# Altium schematic sheet Touchscreen.SchDoc
size A
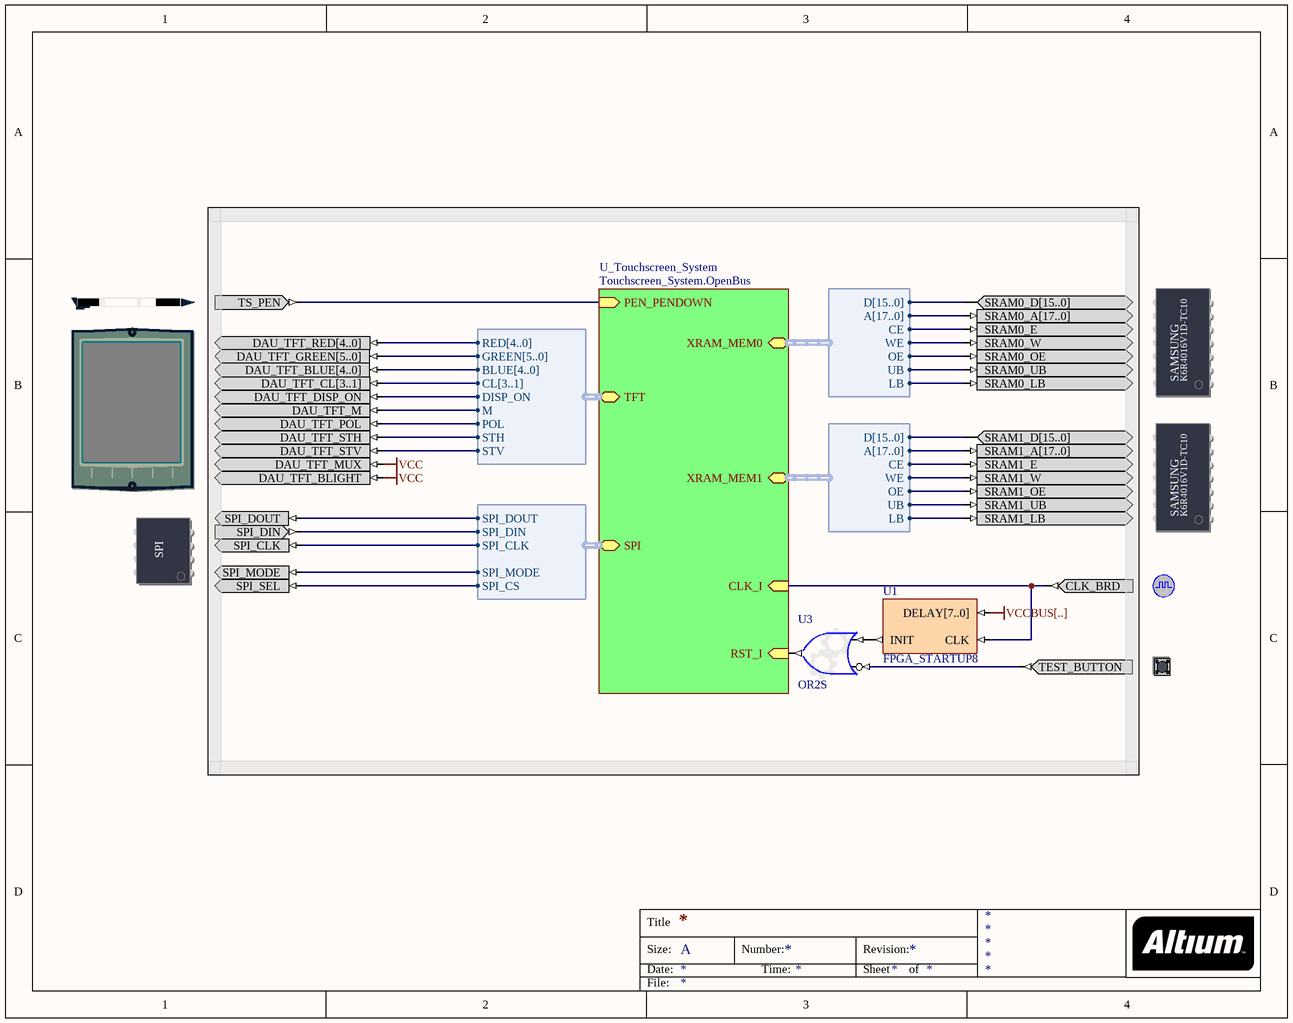
[diagram p0: Touchscreen.SchDoc]

## Parts
(Parts that share a designator on the sheet are numbered #1, #2 ... from top to bottom, then left to right.)
?#1  TOUCHSCREEN_PEN_DOWN  (value not drawn)
?#2  SRAM_DAUGHTER0  (value not drawn)
?#3  TFT_LCD  (value not drawn)
?#4  SRAM_DAUGHTER1  (value not drawn)
?#5  SPI_BUS  (value not drawn)
?#6  CLOCK_BOARD  (value not drawn)
?#7  TEST_BUTTON  (value not drawn)
U1  FPGA_STARTUP8
U3  OR2S

## Sub-sheets
U_Touchscreen_System = Touchscreen_System.OpenBus: CLK_I (in), RST_I (in), SPI (harness SPI_W_NB), PEN_PENDOWN (in), TFT (harness VGA32_TFT), XRAM_MEM0 (harness WB_MEM_CTRL_SRAM16_A18), XRAM_MEM1 (harness WB_MEM_CTRL_SRAM16_A18)

## Harnesses
WB_MEM_CTRL_SRAM16_A18: D[15..0], A[17..0], CE, WE, OE, UB, LB
VGA32_TFT: RED[4..0], GREEN[5..0], BLUE[4..0], CL[3..1], DISP_ON, M, POL, STH, STV
SPI_W_NB: SPI_DOUT, SPI_DIN, SPI_CLK, SPI_MODE, SPI_CS

## Nets
VCC: ?#3.DAU_TFT_BLIGHT ?#3.DAU_TFT_MUX
VCCBUS[..]: U1.DELAY[7..0]
Net?#1_TS_PEN: ?#1.TS_PEN ; sheet U_Touchscreen_System/PEN_PENDOWN
Net?#2_SRAM0_A[17..0]: ?#2.SRAM0_A[17..0] ; sheet U_Touchscreen_System/XRAM_MEM0.A[17..0]
Net?#2_SRAM0_D[15..0]: ?#2.SRAM0_D[15..0] ; sheet U_Touchscreen_System/XRAM_MEM0.D[15..0]
Net?#2_SRAM0_E: ?#2.SRAM0_E ; sheet U_Touchscreen_System/XRAM_MEM0.CE
Net?#2_SRAM0_LB: ?#2.SRAM0_LB ; sheet U_Touchscreen_System/XRAM_MEM0.LB
Net?#2_SRAM0_OE: ?#2.SRAM0_OE ; sheet U_Touchscreen_System/XRAM_MEM0.OE
Net?#2_SRAM0_UB: ?#2.SRAM0_UB ; sheet U_Touchscreen_System/XRAM_MEM0.UB
Net?#2_SRAM0_W: ?#2.SRAM0_W ; sheet U_Touchscreen_System/XRAM_MEM0.WE
Net?#3_DAU_TFT_BLUE[4..0]: ?#3.DAU_TFT_BLUE[4..0] ; sheet U_Touchscreen_System/TFT.BLUE[4..0]
Net?#3_DAU_TFT_CL[3..1]: ?#3.DAU_TFT_CL[3..1] ; sheet U_Touchscreen_System/TFT.CL[3..1]
Net?#3_DAU_TFT_DISP_ON: ?#3.DAU_TFT_DISP_ON ; sheet U_Touchscreen_System/TFT.DISP_ON
Net?#3_DAU_TFT_GREEN[5..0]: ?#3.DAU_TFT_GREEN[5..0] ; sheet U_Touchscreen_System/TFT.GREEN[5..0]
Net?#3_DAU_TFT_M: ?#3.DAU_TFT_M ; sheet U_Touchscreen_System/TFT.M
Net?#3_DAU_TFT_POL: ?#3.DAU_TFT_POL ; sheet U_Touchscreen_System/TFT.POL
Net?#3_DAU_TFT_RED[4..0]: ?#3.DAU_TFT_RED[4..0] ; sheet U_Touchscreen_System/TFT.RED[4..0]
Net?#3_DAU_TFT_STH: ?#3.DAU_TFT_STH ; sheet U_Touchscreen_System/TFT.STH
Net?#3_DAU_TFT_STV: ?#3.DAU_TFT_STV ; sheet U_Touchscreen_System/TFT.STV
Net?#4_SRAM1_A[17..0]: ?#4.SRAM1_A[17..0] ; sheet U_Touchscreen_System/XRAM_MEM1.A[17..0]
Net?#4_SRAM1_D[15..0]: ?#4.SRAM1_D[15..0] ; sheet U_Touchscreen_System/XRAM_MEM1.D[15..0]
Net?#4_SRAM1_E: ?#4.SRAM1_E ; sheet U_Touchscreen_System/XRAM_MEM1.CE
Net?#4_SRAM1_LB: ?#4.SRAM1_LB ; sheet U_Touchscreen_System/XRAM_MEM1.LB
Net?#4_SRAM1_OE: ?#4.SRAM1_OE ; sheet U_Touchscreen_System/XRAM_MEM1.OE
Net?#4_SRAM1_UB: ?#4.SRAM1_UB ; sheet U_Touchscreen_System/XRAM_MEM1.UB
Net?#4_SRAM1_W: ?#4.SRAM1_W ; sheet U_Touchscreen_System/XRAM_MEM1.WE
Net?#5_SPI_CLK: ?#5.SPI_CLK ; sheet U_Touchscreen_System/SPI.SPI_CLK
Net?#5_SPI_DIN: ?#5.SPI_DIN ; sheet U_Touchscreen_System/SPI.SPI_DIN
Net?#5_SPI_DOUT: ?#5.SPI_DOUT ; sheet U_Touchscreen_System/SPI.SPI_DOUT
Net?#5_SPI_MODE: ?#5.SPI_MODE ; sheet U_Touchscreen_System/SPI.SPI_MODE
Net?#5_SPI_SEL: ?#5.SPI_SEL ; sheet U_Touchscreen_System/SPI.SPI_CS
Net?#6_CLK_BRD: ?#6.CLK_BRD U1.CLK ; sheet U_Touchscreen_System/CLK_I
Net?#7_TEST_BUTTON: ?#7.TEST_BUTTON U3.I1
NetU1_INIT: U1.INIT U3.I0
NetU3_O: U3.O ; sheet U_Touchscreen_System/RST_I

## Notes on the sheet
- Title
- Size:
- Date:
- A
- Number:
- Time:
- Revision:
- Sheet
- of
- File:
- (in symbol SPI_BUS) SPI
- (in symbol SRAM_DAUGHTER0) SAMSUNG; K6R4016V1D-TC10
- (in symbol SRAM_DAUGHTER1) SAMSUNG; K6R4016V1D-TC10

## Library data of the parts
?#1 = TOUCH_SCREEN_PEN: TFT Touch Screen Pen; PortComponent: True; Published: 22-Jan-2007; Publisher: Altium Limited; HelpURL: TR0143 Technical Reference Manual for Altium's Desktop NanoBoard NB2DSK01.pdf#page=50
?#2 = SRAM_DAUGHTER0: Free Static RAM - Daughterboard; PortComponent: True; Published: 14-May-2007; Publisher: Altium Limited; HelpURL: TR0149 Technical Reference for Altium's Xilinx Spartan-3 Daughter Board DB30.pdf#page=16
?#3 = TFT_LCD: TFT LCD Panel; PortComponent: True; Published: 22-Jan-2007; Publisher: Altium Limited; HelpURL: TR0143 Technical Reference Manual for Altium's Desktop NanoBoard NB2DSK01.pdf#page=50
?#4 = SRAM_DAUGHTER1: Free Static RAM - Daughterboard; PortComponent: True; Published: 14-May-2007; Publisher: Altium Limited; HelpURL: TR0149 Technical Reference for Altium's Xilinx Spartan-3 Daughter Board DB30.pdf#page=16
?#5 = SPI_BUS: Generic SPI Bus; PortComponent: True; Published: 22-Jan-2007; Publisher: Altium Limited; HelpURL: TR0143 Technical Reference Manual for Altium's Desktop NanoBoard NB2DSK01.pdf#page=55
?#6 = CLOCK_BOARD: Global System Clock Supply; PortComponent: True; Published: 19-Nov-2003; Publisher: Altium Limited; HelpURL: TR0143 Technical Reference Manual for Altium's Desktop NanoBoard NB2DSK01.pdf#page=41; UseInDSF: True
?#7 = TEST_BUTTON: Test / Reset Button; PortComponent: True; Published: 19-Nov-2003; Publisher: Altium Limited; HelpURL: TR0143 Technical Reference Manual for Altium's Desktop NanoBoard NB2DSK01.pdf#page=53
U1 = FPGA_STARTUP8: FPGA Startup With 8 Bit Delay; Published: 9-Dec-2004; Publisher: Altium Limited; HelpURL: CR0119 FPGA_STARTUPx Powerup Delay Unit.pdf; LastRevisionNo: 1.00.00; ComponentLink1Description: Core &Resource Usage; ComponentLink1URL: CR0139 FPGA Peripheral Resource Usage.pdf#page=11
U3 = GATE: Configurable Generic Gate; ConfiguratorName: GENERIC_GATE; ConfigurationParameters: {}Version[1.0]{}GateKind[OR]{}BusInput[False]{}GateInputType[Bit]{}GateOutputOption[Normal]{}BusWidth[8]{}RegisterOutputs[False]{}NegativeClockEdge[False]{}InputCount[2]{}InputInvert0[False]{}InputInvert1[True]{}; LastRevisionNo: 1.00.00; Published: 3-Sep-2008; Publisher: Altium Limited